# EAGLE design VNH7070AS motor driver (EAGLE 9.6.2)
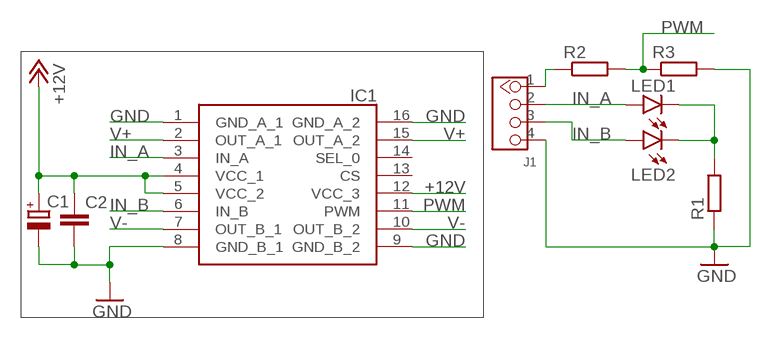
[diagram p0: schematic, sheet 1]

## Parts
C1  CPOL-EUCT7343  [CT7343]
C2  C-EUC0805  [C0805]
IC1  VNH7070ASTR  [SOIC127P600X175-16N]
J1  TWIG_2.0  [2.0_1X4]
LED1  LEDCHIPLED_1206  [CHIPLED_1206]
LED2  LEDCHIPLED_1206  [CHIPLED_1206]
R1  R-EU_R0805  [R0805]
R2  R-EU_R0805  [R0805]
R3  R-EU_R0805  [R0805]

## Nets
+12V: C1.+ C2.1 IC1.4(VCC_1) IC1.5(VCC_2) IC1.12(VCC_3)
GND: C1.- C2.2 IC1.1(GND_A_1) IC1.8(GND_B_1) IC1.9(GND_B_2) IC1.16(GND_A_2) J1.4 R1.1 R3.2
IN_A: IC1.3(IN_A) J1.2 LED1.A
IN_B: IC1.6(IN_B) J1.3 LED2.A
N$1: J1.1 R2.1
N$3: LED1.C LED2.C R1.2
PWM: IC1.11(PWM) R2.2 R3.1
V+: IC1.2(OUT_A_1) IC1.15(OUT_A_2)
V-: IC1.7(OUT_B_1) IC1.10(OUT_B_2)
Unconnected: IC1.13(CS) IC1.14(SEL_0)

## Library data of the parts
C1 = rcl:CPOL-EU: POLARIZED CAPACITOR, European symbol; SPICEPREFIX: C
C2 = rcl:C-EU: CAPACITOR, European symbol; SPICEPREFIX: C
IC1 = VNH7070AS:VNH7070ASTR: Motor / Motion / Ignition Controllers & Drivers Source: Datasheet <http://www.st.com/content/ccc/resource/technical/document/datasheet/08/97/0a/0c/cf/4b/41/40/DM00213876.pdf/files/DM00213876.pdf/jcr:content/translations/en.DM00213876.pdf>; DESCRIPTION: Motor / Motion / Ignition Controllers & Drivers; HEIGHT: 1.75mm; MANUFACTURER_NAME: STMicroelectronics; MANUFACTURER_PART_NUMBER: VNH7070ASTR; MOUSER_PART_NUMBER: 511-VNH7070ASTR; MOUSER_PRICE-STOCK: https://www.mouser.com/Search/Refine.aspx?Keyword=511-VNH7070ASTR; RS_PART_NUMBER: 1647017P; RS_PRICE-STOCK: http://uk.rs-online.com/web/p/products/1647017P
J1 = CONNECTER:TWIG_2.0
LED1 LED2 = led:LED: LED OSRAM: - CHIPLED LG R971, LG N971, LY N971, LG Q971, LY Q971, LO R971, LY R971 LH N974, LH R974 LS Q976, LO Q976, LY Q976 LO Q996 - Hyper CHIPLED LW Q18S LB Q993, LB Q99A, LB R99A - SideLED LS A670, LO A670, LY A670, LG A670, LP A670 LB A673, LV A673, LT A673, LW A673 LH A674 LY A675 LS A676, LA A676, LO A676, LY A676, LW A676 LS A679, LY A679, LG A679 - Hyper Micro SIDELED® LS Y876, LA Y876, LO Y876, LY Y876 LT Y87S - SmartLED LW L88C, LW L88S LB L89C, LB L89S, LG L890 LS L89K, LO L89K, LY L89K LS L896, LA L896, LO L896, LY L896 - TOPLED LS T670, LO T670, LY T670, LG T670, LP T670 LSG T670, LSP T670, LSY T670, LOP T670, LYG T670 LG T671, LOG T671, LSG T671 LB T673, LV T673, LT T673, LW T673 LH T674 LS T676, LA T676, LO T676, LY T676, LB T676, LH T676, LSB T676, LW T676 LB T67C, LV T67C, LT T67C, LS T67K, LO T67K, LY T67K, LW E67C LS E67B, LA E67B, LO E67B, LY E67B, LB E67C, LV E67C, LT E67C LW T67C LS T679, LY T679, LG T679 LS T770, LO T770, LY T770, LG T770, LP T770 LB T773, LV T773, LT T773, LW T773 LH T774 LS E675, LA E675, LY E675, LS T675 LS T776, LA T776, LO T776, LY T776, LB T776 LHGB T686 LT T68C, LB T68C - Hyper Mini TOPLED® LB M676 - Mini TOPLED Santana® LG M470 LS M47K, LO M47K, LY M47K Source: http://www.osram.convergy.de LUXEON: - LUMILED® LXK2-PW12-R00, LXK2-PW12-S00, LXK2-PW14-U00, LXK2-PW14-V00 LXK2-PM12-R00, LXK2-PM12-S00, LXK2-PM14-U00 LXK2-PE12-Q00, LXK2-PE12-R00, LXK2-PE12-S00, LXK2-PE14-T00, LXK2-PE14-U00 LXK2-PB12-K00, LXK2-PB12-L00, LXK2-PB12-M00, LXK2-PB14-N00, LXK2-PB14-P00, LXK2-PB14-Q00 LXK2-PR12-L00, LXK2-PR12-M00, LXK2-PR14-Q00, LXK2-PR14-R00 LXK2-PD12-Q00, LXK2-PD12-R00, LXK2-PD12-S00 LXK2-PH12-R00, LXK2-PH12-S00 LXK2-PL12-P00, LXK2-PL12-Q00, LXK2-PL12-R00 Source: www.luxeon.com KINGBRIGHT: KA-3528ASYC Source: www.kingbright.com
R1-R3 = rcl:R-EU_: RESISTOR, European symbol; SPICEPREFIX: R

## Board
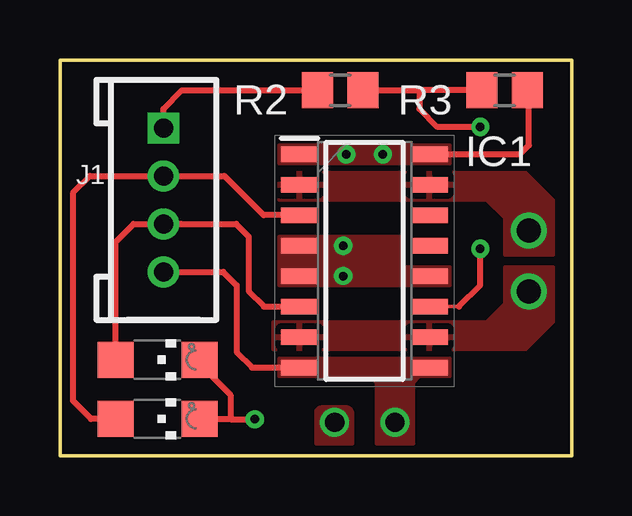
[diagram p1: board, top side]
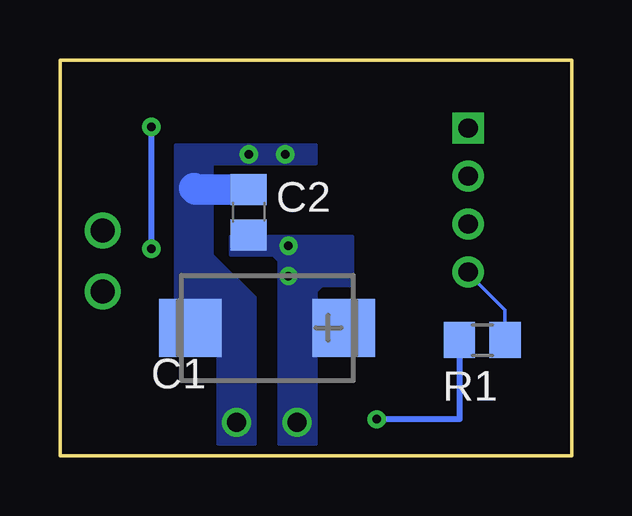
[diagram p2: board, bottom side, seen from below]

Size 21.34 x 16.51 mm. Coordinates in mm from the lower left corner, seen from the top.
Outline: 0,16.51 0,0 21.34,0 21.34,16.51 0,16.51
Copper layers (1*16): Top 0.035mm / dielectric 1.5mm / Bottom 0.035mm
Design rules "default *": minimum track width 6mil, minimum drill 0.35mm, track to track 6mil, track to pad 6mil, pad to pad 6mil, via to via 6mil, smd to smd 6mil, copper to edge 0mil, drill to drill 6mil, minimum pad ring 10mil, minimum via ring 8mil, stop-mask expansion 4mil, vias tented up to drill 0mil, thermal gap 10mil

### Footprints (pad centres in the part's own frame; a part is rotated, then mirrored left to right if it is on the bottom)
CT7343 = smd 2.6 x 2.4: + -3.2,0; - 3.2,0
C0805 = smd 1.3 x 1.5: 1 -0.95,0; 2 0.95,0
SOIC127P600X175-16N = smd 1.525 x 0.65: 1 -2.712,4.445; 2 -2.712,3.175; 3 -2.712,1.905; 4 -2.712,0.635; 5 -2.712,-0.635; 6 -2.712,-1.905; 7 -2.712,-3.175; 8 -2.712,-4.445; 9 2.712,-4.445; 10 2.712,-3.175; 11 2.712,-1.905; 12 2.712,-0.635; 13 2.712,0.635; 14 2.712,1.905; 15 2.712,3.175; 16 2.712,4.445
2.0_1X4 = drill 0.8 pad 1.27 square: 1 -3,0 | drill 0.8 pad 1.27: 2 -1,0; 3 1,0; 4 3,0
CHIPLED_1206 = smd 1.5 x 1.5: A 0,-1.75; C 0,1.75
R0805 = smd 1.3 x 1.5: 1 -0.95,0; 2 0.95,0

### Placement (x,y rotation side)
C1  12.7,5.33 180 bottom
C2  13.46,10.16 90 bottom
IC1  12.7,8.13 0 top
J1  4.32,10.67 270 top
LED1  4.06,1.54 270 top
LED2  4.06,4 270 top
R1  3.72,4.83 180 bottom
R2  11.68,15.24 0 top
R3  18.54,15.24 0 top

### Tracks (layer width: path | path; a pad name or v marks a point on that pad's centre or on a via)
+12V  (via drill 0.35, 0.8)
  other vias: 11.46,1.4 11.81,8.76 11.81,7.49
  pour Top (no thermals): 12.19,0.51 12.19,1.78 arc90 11.94,2.03 10.92,2.03 arc90 10.67,1.78 10.67,0.51
  pour Bottom (no thermals): 12.19,0.51 12.19,1.78 arc90 11.94,2.03 10.92,2.03 arc90 10.67,1.78 10.67,0.51
  pour Top (no thermals): 16.26,7.87 14.22,7.87 14.22,9.14 9.14,9.14 9.14,7.11 16.26,7.11
  pour Bottom (no thermals): 10.67,1.02 12.19,1.02 12.19,8.13 12.45,8.38 14.22,8.38 14.22,9.14 9.14,9.14 9.14,7.11 10.41,7.11 10.67,6.86
GND  (via drill 0.35, 0.8)
  Top 0.152: 19.56,15.17 R3.2
  Top 0.254: J1.4 6.81,7.67 7.37,7.11 7.37,4.32 8,3.68 IC1.8 | IC1.16 19.18,12.57 19.56,12.95 19.56,15.17
  Bottom 0.152: R1.1 2.77,6.08 4.32,7.62 J1.4
  Bottom 1.27: C2.2 15.68,11.11 15.75,11.18
  other vias: 13.97,1.4 11.94,12.57 13.46,12.57
  pour Top (no thermals): 13.21,0.51 13.21,1.78 arc-90 13.46,2.03 14.48,2.03 arc-90 14.73,1.78 14.73,0.51
  pour Bottom (no thermals): 13.21,0.51 13.21,1.78 arc-90 13.46,2.03 14.48,2.03 arc-90 14.73,1.78 14.73,0.51
  pour Top (no thermals): 9.14,12.95 16.26,12.95 16.26,12.19 9.14,12.19
  pour Bottom (no thermals): 10.67,12.95 16.26,12.95 16.26,12.19 10.67,12.19
  pour Top (no thermals): 9.14,4.06 16.26,4.06 16.26,3.3 14.99,3.3 14.73,3.05 14.73,1.02 13.21,1.02 13.21,3.05 12.95,3.3 9.14,3.3
  pour Bottom (no thermals): 13.21,6.6 14.99,8.38 14.99,8.64 14.99,12.95 16.51,12.95 16.51,6.1 14.73,4.32 14.73,1.02 13.21,1.02
IN_A
  Top 0.254: IC1.3 8.49,10.03 6.86,11.67 J1.2 1.25,11.67 0.54,10.95 0.54,2.3 1.3,1.54 LED1.A
IN_B
  Top 0.254: IC1.6 8.51,6.22 7.87,6.86 7.87,9.14 7.35,9.67 J1.3 | 5.06,9.67 J1.3 | LED2.A 2.31,8.92 3.06,9.67 J1.3
N$1
  Top 0.254: J1.1 4.32,14.48 5.08,15.24 R2.1
N$3  (via drill 0.35)
  Top 0.152: 6.62,1.54 6.6,1.54
  Top 0.254: LED1.C 6.6,1.54 7.11,1.54 | v8.13,1.52 7.11,1.52 7.11,2.54 5.81,3.84 LED2.C
  Bottom 0.254: R1.2 4.67,1.52 v8.13,1.52
PWM  (via drill 0.35)
  Top 0.152: IC1.11 16.64,6.22
  Top 0.254: v17.53,8.64 17.53,7.11 16.64,6.22 | R2.2 14.99,15.24 | R3.1 14.99,15.24 | 14.99,15.24 14.99,14.48 15.75,13.72 v17.53,13.72
  Bottom 0.254: v17.53,13.72 v17.53,8.64
V+  (via drill 1)
  other vias: 19.56,9.4
  pour Top: 9.14,11.81 16.26,11.81 16.26,10.67 9.14,10.67
  pour Top: 16,11.81 16,10.67 17.78,10.67 18.54,9.91 18.54,8.38 20.57,8.38 20.57,10.67 19.43,11.81
V-  (via drill 1)
  other vias: 19.56,6.86
  pour Top: 8.89,5.33 8.89,4.45 16.51,4.45 16.51,5.59 8.89,5.59
  pour Top: 16.26,5.59 17.78,5.59 18.54,6.35 18.54,7.87 20.57,7.87 20.57,5.59 19.43,4.45 16.26,4.45